# Altium schematic sheet BatteryMonitor.SchDoc
size A3; SheetNumber: 8; SheetTotal: 8
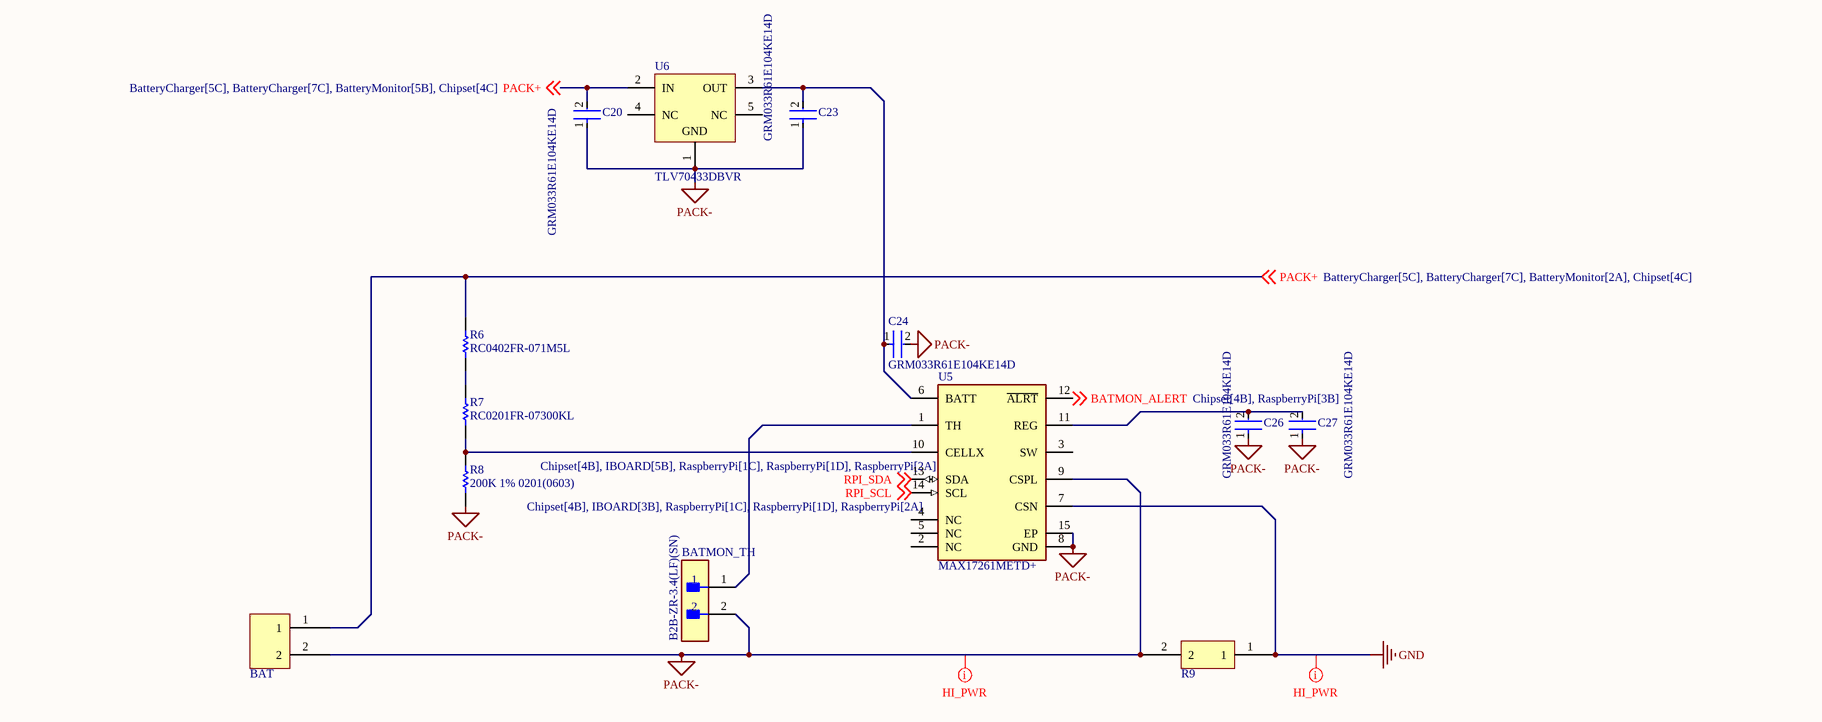
[diagram p0: BatteryMonitor.SchDoc]

## Parts
BAT  WJ500V-5.08-2P  [WJ500V-5.08-2P]  (value not drawn)
BATMON_TH  B2B-ZR-3.4(LF)(SN)  [FP-B2B-ZR-3_4_LF_SN-MFG]
C20  GRM033R61E104KE14D  [FP-GRM033-0_03-IPC_B]
C23  GRM033R61E104KE14D  [FP-GRM033-0_03-IPC_B]
C24  GRM033R61E104KE14D  [FP-GRM033-0_03-IPC_B]
C26  GRM033R61E104KE14D  [FP-GRM033-0_03-IPC_B]
C27  GRM033R61E104KE14D  [FP-GRM033-0_03-IPC_B]
R6  RC0402FR-071M5L  [RESC1005X40X25NL05T10]
R7  RC0201FR-07300KL  [RESC0201(0603)_L]
R8  200K 1% 0201(0603)  [RESC0201(0603)_N]
R9  HoYLR2512-3W-10mR-1%  [HoYLR2512-3W-10mR-1%]  (value not drawn)
U5  MAX17261METD+  [FP-T1433-2C-MFG]
U6  TLV70433DBVR  [DBV0005A_M]

## Nets
GND: R9.1 U5.7(CSN)
PACK-: BAT.2 BATMON_TH.2 C20.1 C23.1 C24.2 C26.1 C27.1 R8.1 R9.2 U5.8(GND) U5.9(CSPL) U5.15(EP) U6.1(GND)
BATMON_ALERT: U5.12(~{ALRT}) ; off-sheet BATMON_ALERT
PACK+: BAT.1 C20.2 R6.2 U6.2(IN) ; off-sheet PACK+
RPI_SCL: U5.14(SCL) ; off-sheet RPI_SCL
RPI_SDA: U5.13(SDA) ; off-sheet RPI_SDA
NetBATMON_TH_1: BATMON_TH.1 U5.1(TH)
NetC23_2: C23.2 C24.1 U5.6(BATT) U6.3(OUT)
NetC26_2: C26.2 C27.2 U5.11(REG)
NetR6_1: R6.1 R7.2
NetR7_1: R7.1 R8.2 U5.10(CELLX)

Not connected (* = marked no-connect by the designer): U5 2(NC) 3(SW) 4(NC) 5(NC); U6 4(NC) 5(NC)

## Layout directives
net class HI_PWR: GND, PACK-

## Library data of the parts
BATMON_TH = CMP-17439-000601-1: CONN HEADER VERT 2POS 1.5MM; Mated Stacking Heights: 5.6mm; Voltage Rating: 50V; Number of Positions: 2; Termination: Press-Fit; Insulation Color: Natural; Pitch: 1.5mm; Number of Rows: 1; Fastening Type: Detent; Insulation Material: Nylon; Contact Shape: Circular; Lead Free: Lead Free; Series: ZH; Connector Type: Header; Contact Type: Male Pin; Packaging: Bulk; Contact Finish - Mating: TIN; Mount: Through Hole; Contact Material: Brass; Flammability Rating: UL94 V-0
C20 C23 C24 C26 C27 = CMP-06035-036234-1: Chip Multilayer Ceramic Capacitors for General Purpose, 0201, 0.10uF, X5R, 15%, 10%, 25V; Capacitance: 100nF; Case/Package: 0201; Mount: Surface Mount; Resistor Type: Ceramic; Package Quantity: 15000; Height: 0.3mm; Length: 0.024inch; Weight: 1.2E-05oz; Dielectric: X5R; Thickness: 0.013inch; Max Operating Temperature: 85°C; Case Code (Imperial): 0201; Voltage Rating: 25V; Case Code (Metric): 0603; Voltage Rating (DC): 25V; Width: 0.012inch; Termination: SMD/SMT; Tolerance: 10%; Min Operating Temperature: -55°C; Packaging: Tape and Reel; Lead Free: Lead Free
R6 = CMP-2002-07106-1: Manufacturer: Yageo / Phycomp; Part Number: RC0402FR-071M5L
R7 = CMP-1010-00694-1: 300K 0.05W 1% 0201 (0603 Metric)  SMD; Case-Metric: 0603; Value: 300000.00 Ohm; Case-EIA: 0201; Power: 0.05 W; Technology: SMT; Tolerance: 1 %
R8 = CMP-1010-00674-1: 200K 0.05W 1% 0201 (0603 Metric)  SMD; Value: 200000.00 Ohm; Case-EIA: 0201; Case-Metric: 0603; Technology: SMT; Tolerance: 1 %; Power: 0.05 W
R9 = HoYLR2512-3W-10mR-1%: Resistance: 10mOhm
U5 = CMP-05715-000069-1: IC FUEL GAUGE LI+ M5 EZ 14TDFN; Manufacturer: Maxim; Max Junction Temp: +150°C; Standoff Height: 0mm; Max Supply Voltage: 4.9V; Min Supply Voltage: 2.3V; Nominal Supply Current: 15uA; Footprint Url: https://pdfserv.maximintegrated.com/land_patterns/90-0063.PDF; RoHS: TRUE; Automotive: No; Octopart: https://octopart.com/max17261metd%2B-maxim+integrated-91765041; Lead Free: Yes; ComponentLink2URL: https://datasheets.maximintegrated.com/en/ds/MAX17261.pdf; Temperature: -40°C to +85°C; Device Class L1: Integrated Circuits (ICs); Manufacturer Part Number: MAX17261METD+; Temperature Range High: +85°C; Temperature Range Low: -40°C; ComponentLink2Description: Datasheet; Package: T1433-2C; Height: 0.8mm; Category: IC; Digikey Description: IC FUEL GAUGE LI+ M5 EZ 14TDFN; Device Class L2: Power Management ICs; Device Class L3: Battery Management; Mouser Description: 5.1µA Multi-Cell Fuel Gauge with ModelGauge m5 EZ
U6 = CMP-0394-00651-2: Single Output LDO, 150 mA, Fixed 3.3 V Output, 2.5 to 24 V Input, with Ultra-Low IQ, 5-pin SOT-23 (DBV), -40 to 125 degC, Green (RoHS & no Sb/Br); Manufacturer: Texas Instruments; Vdo(Typ)(mV): 400; Accuracy(%): 2; Vin(Min)(V): 2.5; Vin(Max)(V): 24; SubFamily: Single Channel LDO; Iq(Typ)(mA): 0.003; Fixed Output Options(V): 3.3; Iout(Max)(A): 0.15; DatasheetVersion: SBVS148C; ComponentLink1URL: http://www.ti.com/; ComponentLink3URL: http://www.ti.com/litv/pdf/mpds018i; Code_JEDEC: MO-178; PackageReference: DBV0005A; PackageDescription: 5-Pin Plastic Small Outline, Body 1.60 Ãƒâ€” 2.90 mm, Pitch 0.95 mm; Mounting Technology: Surface Mount; ComponentLink1Description: Manufacturer URL; Vout Adj(Min)(V): 3.3; PartNumber: TLV70433DBVR; ComponentLink2Description: Datasheet; PackageVersion: 4073253-4/K; ComponentLink2URL: http://www.ti.com/general/docs/lit/getliterature.tsp?genericPartNumber=TLV70433&fileType=pdf; ComponentLink3Description: Package Specification; Vout Adj(Max)(V): 3.3; Eco-Plan: Green (RoHS & no Sb/Br)